# Altium schematic sheet FPGAConfig.SchDoc
size A4; SheetNumber: 3; SheetTotal: 10
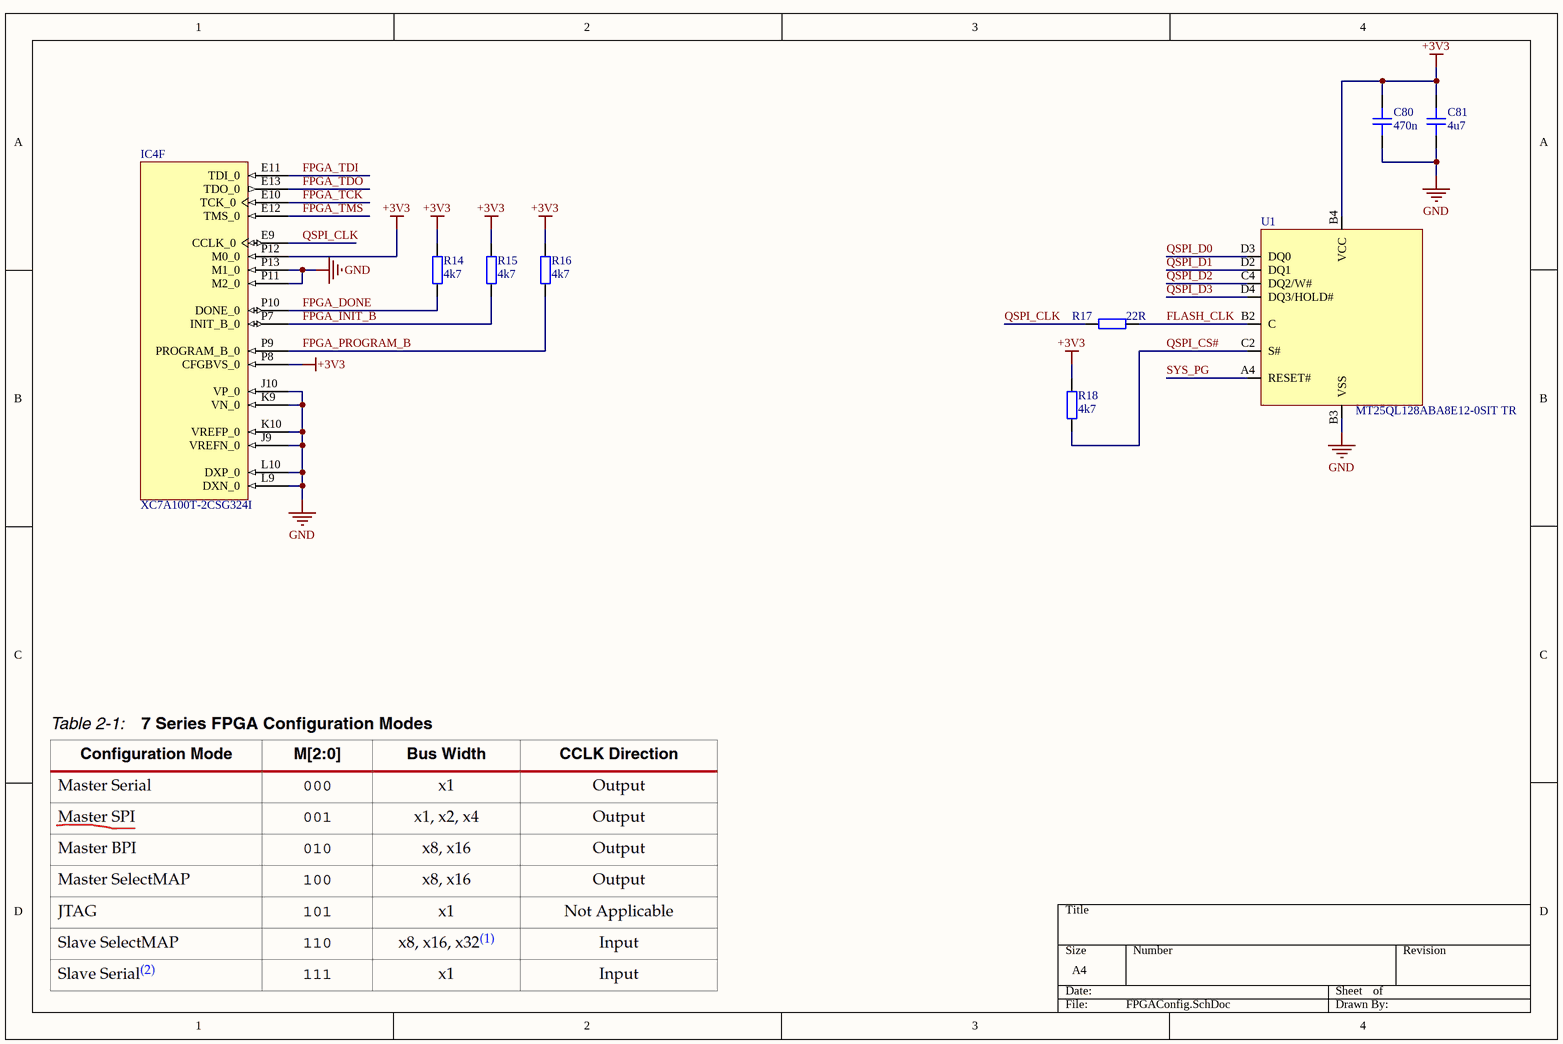
[diagram p0: FPGAConfig.SchDoc]

## Parts
C80  470n  [CAP_0201]
C81  4u7  [CAP_0402]
IC4  XC7A100T-2CSG324I  [CSG324]  (part F of 9)
R14  4k7  [RES_0201]
R15  4k7  [RES_0201]
R16  4k7  [RES_0201]
R17  22R  [RES_0201]
R18  4k7  [RES_0201]
U1  MT25QL128ABA8E12-0SIT TR  [T-PBGA-5x5-6x8-24]

## Nets
+3V3: C80.2 C81.2 IC4.P8(CFGBVS_0) IC4.P12(M0_0) R14.2 R15.2 R16.2 R18.2 U1.B4(VCC)
GND: C80.1 C81.1 IC4.J9(VREFN_0) IC4.J10(VP_0) IC4.K9(VN_0) IC4.K10(VREFP_0) IC4.L9(DXN_0) IC4.L10(DXP_0) IC4.P11(M2_0) IC4.P13(M1_0) U1.B3(VSS)
FLASH_CLK: R17.1 U1.B2(C)
FPGA_DONE: IC4.P10(DONE_0) R14.1
FPGA_INIT_B: IC4.P7(INIT_B_0) R15.1
FPGA_PROGRAM_B: IC4.P9(PROGRAM_B_0) R16.1
FPGA_TCK: IC4.E10(TCK_0)
FPGA_TDI: IC4.E11(TDI_0)
FPGA_TDO: IC4.E13(TDO_0)
FPGA_TMS: IC4.E12(TMS_0)
QSPI_CLK: IC4.E9(CCLK_0) R17.2
QSPI_CS#: R18.1 U1.C2(S#)
QSPI_D0: U1.D3(DQ0)
QSPI_D1: U1.D2(DQ1)
QSPI_D2: U1.C4(DQ2/W#)
QSPI_D3: U1.D4(DQ3/HOLD#)
SYS_PG: U1.A4(RESET#)

## Library data of the parts
C80 = CAP_0201: Capacitor SMD 0201; Manufacturer: *; Manufacturer Part Number: *; Distributor Link: *; LCSC: *; Rating: *; Dielectric: *
C81 = CAP_0402: Capacitor SMD 0402; Manufacturer: *; Manufacturer Part Number: *; Distributor Link: *; LCSC: *; Rating: *; Dielectric: *
IC4 = XC7A100T-2CSG324I: Artix-7 FPGA, 210 User I/Os, 0 GTP, 324-Ball BGA, Speed Grade 2, Industrial Grade, Pb-Free; Manufacturer: Xilinx; Logic Cells: 101440; DSP48E1 Slices: 240; Block RAM Blocks (Max Kb): 4860; Clock Mgmt Tiles (CMTs): 6; Max User I/O: 300; CLBs (Slices): 15850; Block RAM Blocks (18Kb): 270; Speed Grade: -2; Block RAM Blocks (36Kb): 135; ComponentLink1Description: Datasheet; ComponentLink3Description: DC and Switching Characteristics; Generic Part Number: XC7A100T; RoHS: Pb-Free; Mounting Technology: Surface Mount; PackageReference: CSG324; ComponentLink4URL: http://www.xilinx.com/support/packagefiles/a7packages/xc7a100tcsg324pkg.txt; NexusDeviceID: XC7A100T-2CSG324I; PackageVersion: Rev 1.8; PartNumber: XC7A100T-2CSG324I; CLBs (Max Distributed RAM Kb): 1188; Code_JEDEC: MO-275-KKAC-1; ComponentLink2Description: Package Specification; ComponentLink1URL: http://www.xilinx.com/support/documentation/data_sheets/ds180_7Series_Overview.pdf; ComponentLink3URL: http://www.xilinx.com/support/documentation/data_sheets/ds181_Artix_7_Data_Sheet.pdf; ComponentLink5URL: http://www.xilinx.com/support/documentation/user_guides/ug475_7Series_Pkg_Pinout.pdf; PackageDescription: Wire-Bond Chip-Scale BGA, Body 15 x 15 mm, 0.8 mm Pitch; ComponentLink4Description: Package File; DatasheetVersion: v1.12; ComponentLink2URL: http://www.xilinx.com/support/documentation/user_guides/ug475_7Series_Pkg_Pinout.pdf; ComponentLink5Description: Packaging and Pinout
R14-R18 = RES_0201: Resistor SMD 0201; Manufacturer: *; Manufacturer Part Number: *; Distributor Link: *; LCSC: *
U1 = MT25QL128ABA8E12-0SIT: NOR Flash QSPI 128 Mbit T-PBGA-24; Manufacturer: Micron Technology; Manufacturer Part Number: MT25QL128ABA8E12-0SIT TR